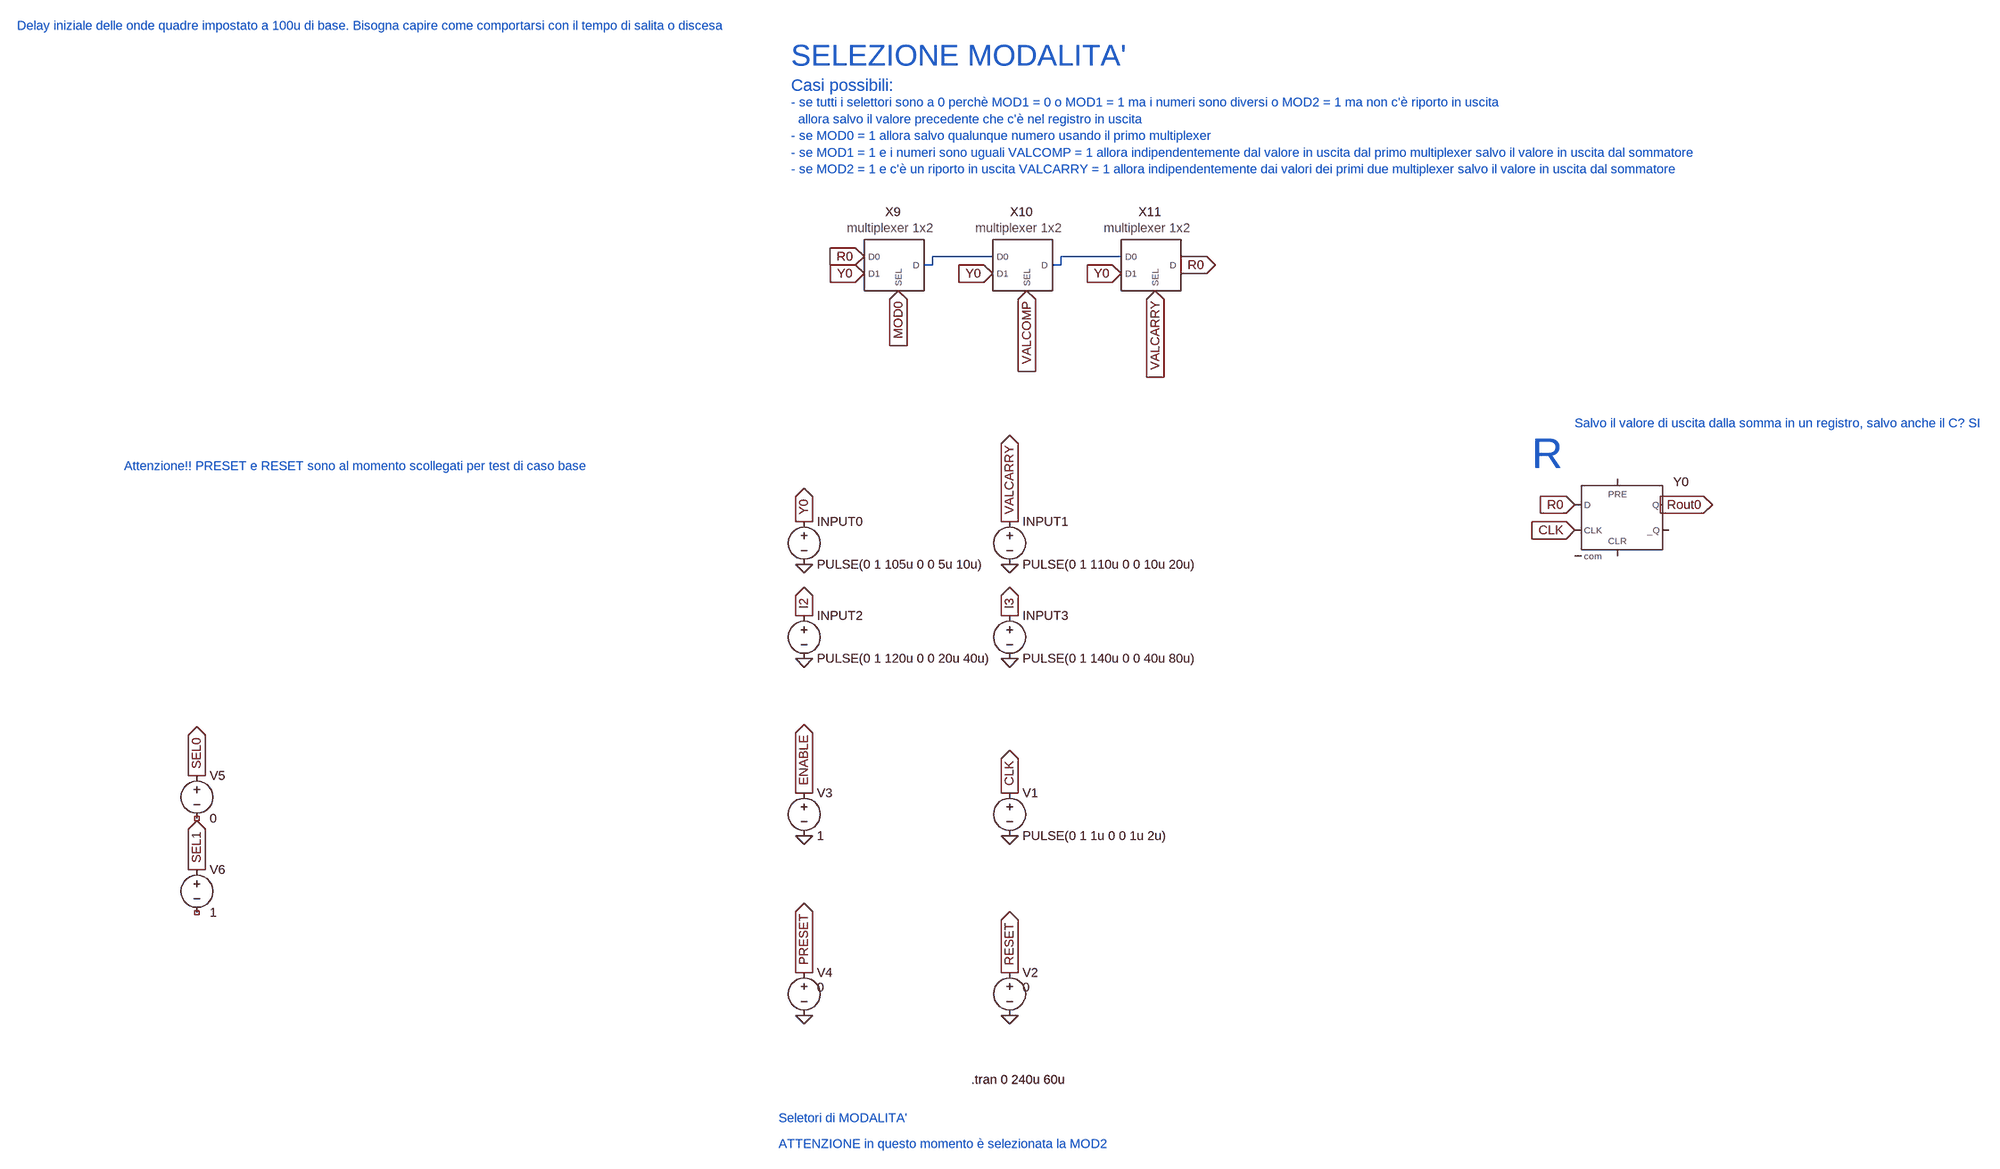
[diagram p0: schematic prova_multiplexer.asc]
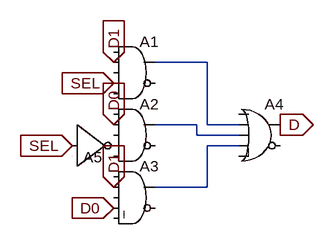
[diagram p1: sub-circuit multiplexer_1x2.asc]
prova_multiplexer.asc, the LTspice schematic file:
Version 4
SHEET 1 4736 1928
WIRE 2656 128 2544 128
WIRE 2896 128 2784 128
WIRE 2544 144 2544 128
WIRE 2544 144 2528 144
WIRE 2784 144 2784 128
WIRE 2784 144 2768 144
FLAG 2688 1216 0
FLAG 2688 1136 CLK
IOPIN 2688 1136 Out
FLAG 3744 640 CLK
IOPIN 3744 640 In
FLAG 3744 592 R0
IOPIN 3744 592 In
FLAG 2304 1216 0
FLAG 2688 1552 0
FLAG 2688 1472 RESET
IOPIN 2688 1472 Out
FLAG 2304 1136 ENABLE
IOPIN 2304 1136 Out
FLAG 2304 1552 0
FLAG 2304 1472 PRESET
IOPIN 2304 1472 Out
FLAG 2304 624 Y0
IOPIN 2304 624 Out
FLAG 2304 800 I2
IOPIN 2304 800 Out
FLAG 2688 624 VALCARRY
IOPIN 2688 624 Out
FLAG 2688 800 I3
IOPIN 2688 800 Out
FLAG 2304 704 0
FLAG 2688 704 0
FLAG 2688 880 0
FLAG 2304 880 0
FLAG 2480 192 MOD0
IOPIN 2480 192 In
FLAG 3904 592 Rout0
IOPIN 3904 592 Out
FLAG 2720 192 VALCOMP
IOPIN 2720 192 In
FLAG 2960 192 VALCARRY
IOPIN 2960 192 In
FLAG 2416 160 Y0
IOPIN 2416 160 In
FLAG 2416 128 R0
IOPIN 2416 128 In
FLAG 2656 160 Y0
IOPIN 2656 160 In
FLAG 2896 160 Y0
IOPIN 2896 160 In
FLAG 3008 144 R0
IOPIN 3008 144 Out
FLAG -1296 1104 SEL0
IOPIN -1296 1104 Out
FLAG -1296 1280 SEL1
IOPIN -1296 1280 Out
SYMBOL voltage 2688 1120 R0
WINDOW 123 0 0 Left 0
WINDOW 39 0 0 Left 0
SYMATTR InstName V1
SYMATTR Value PULSE(0 1 1u 0 0 1u 2u)
SYMBOL dflop 3824 544 R0
SYMATTR InstName Y0
SYMBOL voltage 2688 1456 R0
WINDOW 123 0 0 Left 0
WINDOW 39 0 0 Left 0
WINDOW 3 24 44 Left 2
SYMATTR Value 0
SYMATTR InstName V2
SYMBOL voltage 2304 1120 R0
WINDOW 123 0 0 Left 0
WINDOW 39 0 0 Left 0
SYMATTR InstName V3
SYMATTR Value 1
SYMBOL voltage 2304 1456 R0
WINDOW 123 0 0 Left 0
WINDOW 39 0 0 Left 0
WINDOW 3 24 44 Left 2
SYMATTR Value 0
SYMATTR InstName V4
SYMBOL voltage 2304 608 R0
WINDOW 123 0 0 Left 0
WINDOW 39 0 0 Left 0
SYMATTR InstName INPUT0
SYMATTR Value PULSE(0 1 105u 0 0 5u 10u)
SYMBOL voltage 2304 784 R0
WINDOW 123 0 0 Left 0
WINDOW 39 0 0 Left 0
SYMATTR InstName INPUT2
SYMATTR Value PULSE(0 1 120u 0 0 20u 40u)
SYMBOL voltage 2688 784 R0
WINDOW 123 0 0 Left 0
WINDOW 39 0 0 Left 0
SYMATTR InstName INPUT3
SYMATTR Value PULSE(0 1 140u 0 0 40u 80u)
SYMBOL voltage 2688 608 R0
WINDOW 123 0 0 Left 0
WINDOW 39 0 0 Left 0
SYMATTR InstName INPUT1
SYMATTR Value PULSE(0 1 110u 0 0 10u 20u)
SYMBOL multiplexer_1x2 2480 144 R0
SYMATTR InstName X9
SYMBOL multiplexer_1x2 2720 144 R0
SYMATTR InstName X10
SYMBOL multiplexer_1x2 2960 144 R0
SYMATTR InstName X11
SYMBOL voltage -1296 1088 R0
WINDOW 123 0 0 Left 0
WINDOW 39 0 0 Left 0
SYMATTR InstName V5
SYMATTR Value 0
SYMBOL voltage -1296 1264 R0
WINDOW 123 0 0 Left 0
WINDOW 39 0 0 Left 0
SYMATTR InstName V6
SYMATTR Value 1
TEXT 3744 440 Left 2 ;Salvo il valore di uscita dalla somma in un registro, salvo anche il C? SI
TEXT 3664 496 Left 6 ;R
TEXT 2616 1672 Left 2 !.tran 0 240u 60u
TEXT -1632 -304 Left 2 ;Delay iniziale delle onde quadre impostato a 100u di base. Bisogna capire come comportarsi con il tempo di salita o discesa
TEXT -1432 520 Left 2 ;Attenzione!! PRESET e RESET sono al momento scollegati per test di caso base
TEXT 2256 1744 Left 2 ;Seletori di MODALITA'
TEXT 2280 -248 Left 5 ;SELEZIONE MODALITA'
TEXT 2280 -192 Left 3 ;Casi possibili:
TEXT 2280 -160 Left 2 ;- se tutti i selettori sono a 0 perchè MOD1 = 0 o MOD1 = 1 ma i numeri sono diversi o MOD2 = 1 ma non c'è riporto in uscita \n  allora salvo il valore precedente che c'è nel registro in uscita\n- se MOD0 = 1 allora salvo qualunque numero usando il primo multiplexer\n- se MOD1 = 1 e i numeri sono uguali VALCOMP = 1 allora indipendentemente dal valore in uscita dal primo multiplexer salvo il valore in uscita dal sommatore\n- se MOD2 = 1 e c'è un riporto in uscita VALCARRY = 1 allora indipendentemente dai valori dei primi due multiplexer salvo il valore in uscita dal sommatore
TEXT 2256 1792 Left 2 ;ATTENZIONE in questo momento è selezionata la MOD2

multiplexer_1x2.asc, the sub-circuit schematic file:
Version 4
SHEET 1 880 680
WIRE 272 48 192 48
WIRE 256 144 192 144
WIRE 272 144 272 48
WIRE 320 144 272 144
WIRE 256 160 256 144
WIRE 320 160 256 160
WIRE 320 176 272 176
WIRE 272 240 272 176
WIRE 272 240 192 240
FLAG 384 144 D
IOPIN 384 144 Out
FLAG 64 176 SEL
IOPIN 64 176 In
FLAG 128 80 SEL
IOPIN 128 80 In
FLAG 128 144 D0
IOPIN 128 144 In
FLAG 128 272 D0
IOPIN 128 272 In
FLAG 128 48 D1
IOPIN 128 48 In
FLAG 128 240 D1
IOPIN 128 240 In
SYMBOL Digital\\and 160 0 R0
SYMATTR InstName A1
SYMBOL Digital\\and 160 96 R0
SYMATTR InstName A2
SYMBOL Digital\\and 160 192 R0
SYMATTR InstName A3
SYMBOL Digital\\or 352 96 R0
SYMATTR InstName A4
SYMBOL Digital\\inv 64 112 R0
WINDOW 0 17 82 Left 2
SYMATTR InstName A5

The netlist it stands for:
* prova_multiplexer.asc
V1 CLK 0 PULSE(0 1 1u 0 0 1u 2u)
A§Y0 R0 0 CLK 0 0 0 Rout0 0 DFLOP
V2 RESET 0 0
V3 ENABLE 0 1
V4 PRESET 0 0
V§INPUT0 Y0 0 PULSE(0 1 105u 0 0 5u 10u)
V§INPUT2 I2 0 PULSE(0 1 120u 0 0 20u 40u)
V§INPUT3 I3 0 PULSE(0 1 140u 0 0 40u 80u)
V§INPUT1 VALCARRY 0 PULSE(0 1 110u 0 0 10u 20u)
XX9 R0 Y0 MOD0 N001 multiplexer_1x2
XX10 N001 Y0 VALCOMP N002 multiplexer_1x2
XX11 N002 Y0 VALCARRY R0 multiplexer_1x2
V5 SEL0 NC_01 0
V6 SEL1 NC_02 1

* block symbol definitions
.subckt multiplexer_1x2 D0 D1 SEL D
A1 0 D1 0 SEL 0 0 N001 0 AND
A2 0 D0 0 P001 0 0 N002 0 AND
A3 0 D1 0 D0 0 0 N003 0 AND
A4 0 N001 N002 N003 0 0 D 0 OR
A5 SEL 0 0 0 0 P001 0 0 BUF
.ends multiplexer_1x2

* Salvo il valore di uscita dalla somma in un registro, salvo anche il C? SI
* R
.tran 0 240u 60u
* Delay iniziale delle onde quadre impostato a 100u di base. Bisogna capire come comportarsi con il tempo di salita o discesa
* Attenzione!! PRESET e RESET sono al momento scollegati per test di caso base
* Seletori di MODALITA'
* SELEZIONE MODALITA'
* Casi possibili:
* - se tutti i selettori sono a 0 perchè MOD1 = 0 o MOD1 = 1 ma i numeri sono diversi o MOD2 = 1 ma non c'è riporto in uscita
*   allora salvo il valore precedente che c'è nel registro in uscita
* - se MOD0 = 1 allora salvo qualunque numero usando il primo multiplexer
* - se MOD1 = 1 e i numeri sono uguali VALCOMP = 1 allora indipendentemente dal valore in uscita dal primo multiplexer salvo il valore in uscita dal sommatore
* - se MOD2 = 1 e c'è un riporto in uscita VALCARRY = 1 allora indipendentemente dai valori dei primi due multiplexer salvo il valore in uscita dal sommatore
* ATTENZIONE in questo momento è selezionata la MOD2
.backanno
.end